# EAGLE design controller (EAGLE 6.3)
ABBREV: ctrl; PROJECT: Funksteckdose einfach Controller
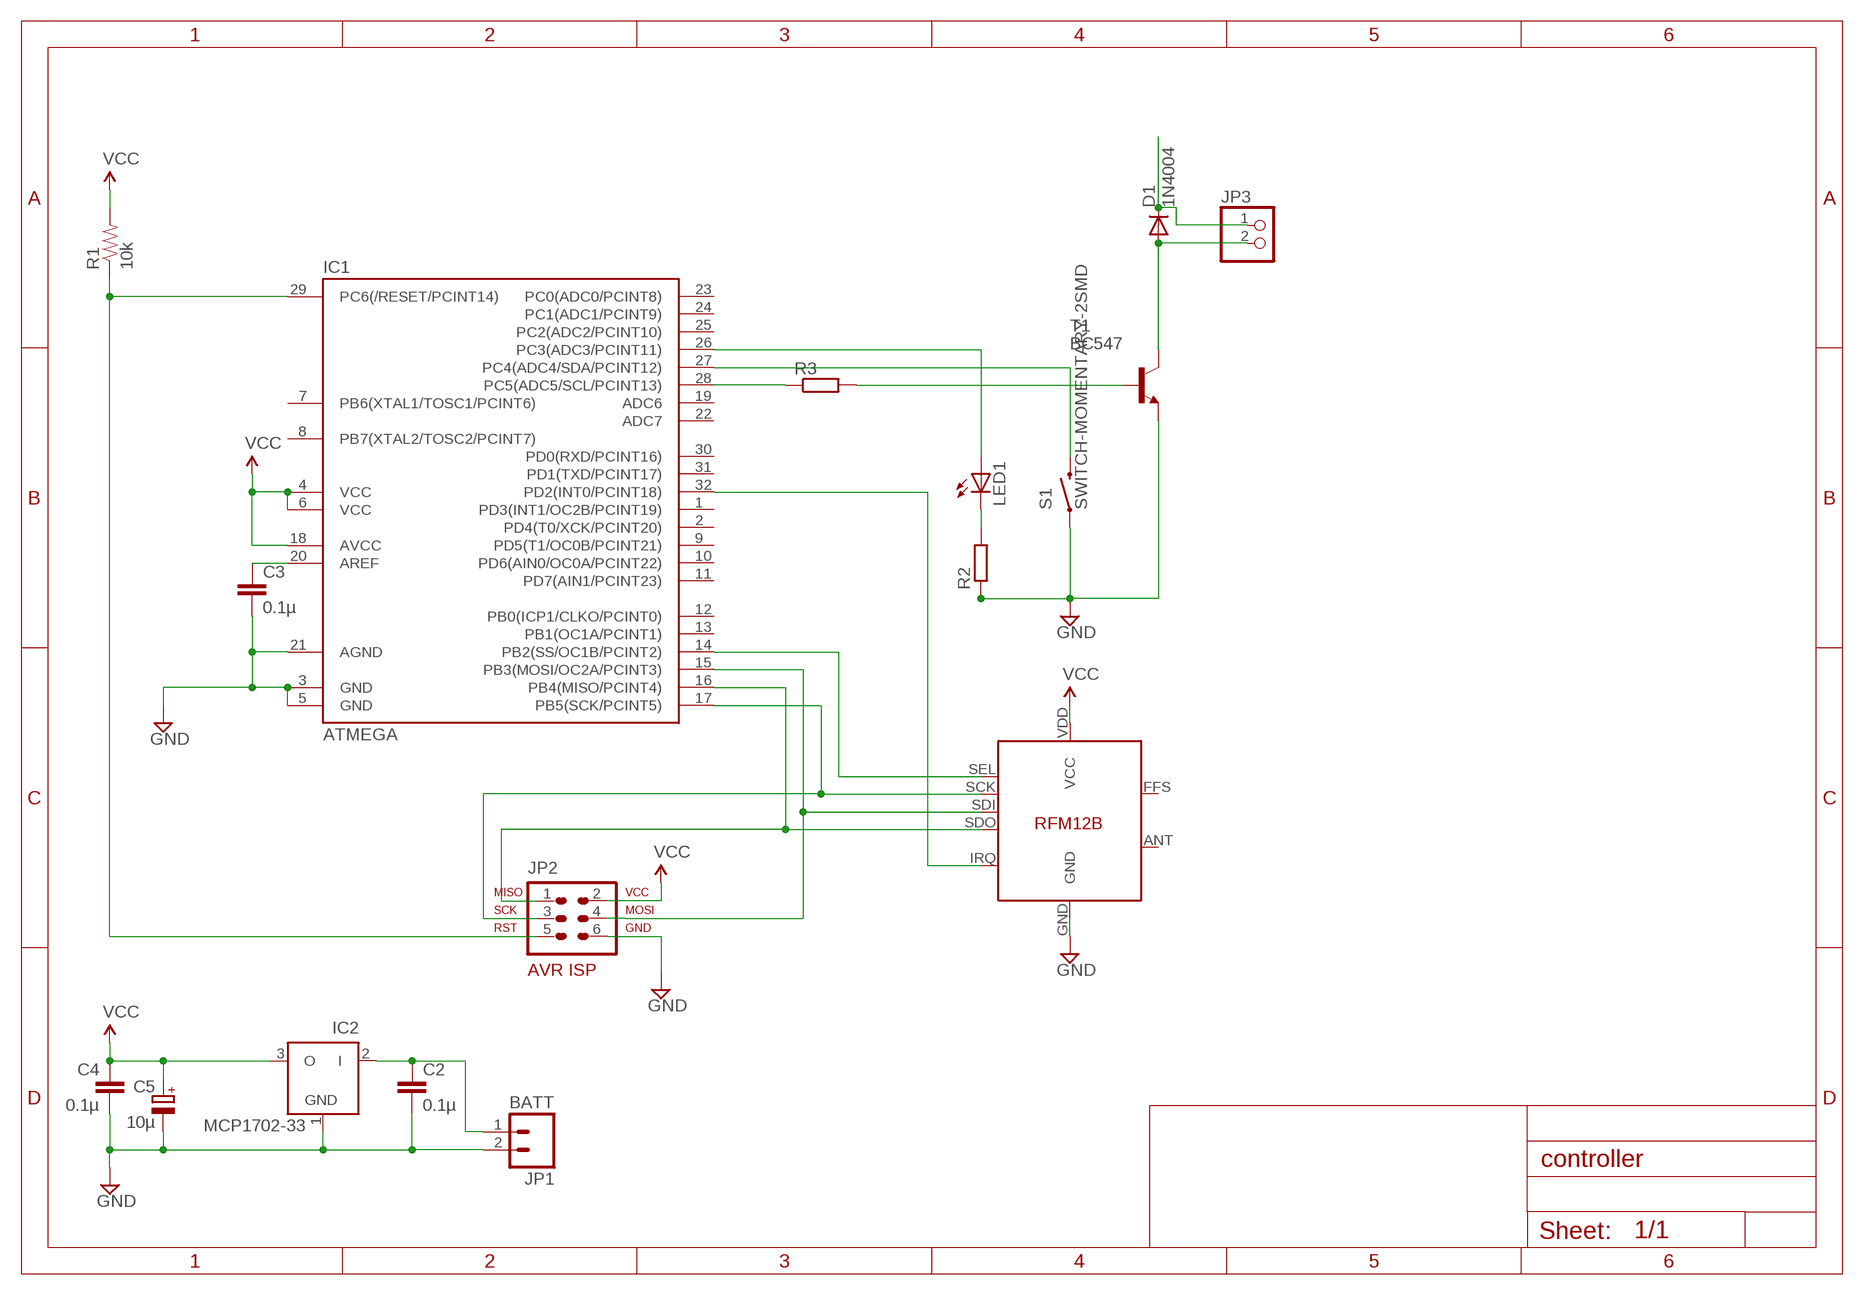
[diagram p0: schematic, sheet 1]

## Parts
C2  0.1µ  CAP0805  [0805]
C3  0.1µ  CAP0805  [0805]
C4  0.1µ  CAP0805  [0805]
C5  10µ  CPOL-EUE1.8-4  [E1,8-4]
D1  1N4004  [DO41-10]
IC1  ATMEGA  MEGA48/88/168-AU  [TQFP32-08]
IC2  MCP1702-33  MCP1702Z  [TO92]
JP1  BATT  M02LOCK_LONGPADS  [1X02_LOCK_LONGPADS]
JP2  AVR-ISP-6VERT  [AVR-ISP-6]
JP3  PINHD-1X2  [1X02]
LED1  LEDCHIPLED_0805  [CHIPLED_0805]
R1  10k  RESISTOR0805-RES  [0805]
R2  R-EU_0207/10  [0207/10]
R3  R-EU_0207/10  [0207/10]
S1  SWITCH-MOMENTARY-2SMD  [TACTILE_SWITCH_SMD]
T1  BC547  [TO92]
U$1  RFM12B  [RFM12B]

## Nets
GND [power]: C2.2 C3.2 C4.2 C5.- IC1.3(GND) IC1.5(GND) IC1.21(AGND) IC2.1(GND) JP1.2 JP2.6 R2.1 S1.1 T1.1(E) U$1.GND
IRQ: IC1.32(PD2(INT0/PCINT18)) U$1.IRQ
MISO: IC1.16(PB4(MISO/PCINT4)) JP2.1 U$1.SDO
MOSI: IC1.15(PB3(MOSI/OC2A/PCINT3)) JP2.4 U$1.SDI
N$1: IC1.28(PC5(ADC5/SCL/PCINT13)) R3.1
N$4: IC1.14(PB2(SS/OC1B/PCINT2)) U$1.SEL
N$6: LED1.C R2.2
N$8: IC1.27(PC4(ADC4/SDA/PCINT12)) S1.3
N$9: R3.2 T1.2(B)
N$10: D1.A JP3.2 T1.3(C)
N$11: IC1.26(PC3(ADC3/PCINT11)) LED1.A
N$19: C3.1 IC1.20(AREF)
PWR [power]: C2.1 D1.C IC2.2(I) JP1.1 JP3.1
RST: IC1.29(PC6(/RESET/PCINT14)) JP2.5 R1.1
SCK: IC1.17(PB5(SCK/PCINT5)) JP2.3 U$1.SCK
VCC [power]: C4.1 C5.+ IC1.4(VCC) IC1.6(VCC) IC1.18(AVCC) IC2.3(O) JP2.2 R1.2 U$1.VDD(VCC)
Unconnected: IC1.1(PD3(INT1/OC2B/PCINT19)) IC1.2(PD4(T0/XCK/PCINT20)) IC1.7(PB6(XTAL1/TOSC1/PCINT6)) IC1.8(PB7(XTAL2/TOSC2/PCINT7)) IC1.9(PD5(T1/OC0B/PCINT21)) IC1.10(PD6(AIN0/OC0A/PCINT22)) IC1.11(PD7(AIN1/PCINT23)) IC1.12(PB0(ICP1/CLKO/PCINT0)) IC1.13(PB1(OC1A/PCINT1)) IC1.19(ADC6) IC1.22(ADC7) IC1.23(PC0(ADC0/PCINT8)) IC1.24(PC1(ADC1/PCINT9)) IC1.25(PC2(ADC2/PCINT10)) IC1.30(PD0(RXD/PCINT16)) IC1.31(PD1(TXD/PCINT17)) U$1.ANT U$1.FFS

## Library data of the parts
C2-C4 = SparkFun:CAP: Capacitor Standard 0603 ceramic capacitor, and 0.1" leaded capacitor.
C5 = resistor:CPOL-EU: POLARIZED CAPACITOR, European symbol
D1 = diode:1N4004: DIODE general purpose rectifier, 1 A
IC1 = avr-7:MEGA48/88/168
IC2 = JeeLabs:MCP1702: 200 mA, Low Power Low Dropout Voltage Regulator
JP1 = SparkFun:M02: Header 2 Standard 2-pin 0.1" header. Use with straight break away headers (SKU : PRT-00116), right angle break away headers (PRT-00553), swiss pins (PRT-00743), machine pins (PRT-00117), and female headers (PRT-00115). Molex polarized connector foot print use with SKU : PRT-08233 with associated crimp pins and housings.
JP2 = avr-7:AVR-ISP-6: AVR ISP-6 Serial Programming Header
JP3 = pinhead:PINHD-1X2: PIN HEADER
LED1 = led:LED: LED OSRAM: - CHIPLED LG R971, LG N971, LY N971, LG Q971, LY Q971, LO R971, LY R971 LH N974, LH R974 LS Q976, LO Q976, LY Q976 LO Q996 - Hyper CHIPLED LW Q18S LB Q993, LB Q99A, LB R99A - SideLED LS A670, LO A670, LY A670, LG A670, LP A670 LB A673, LV A673, LT A673, LW A673 LH A674 LY A675 LS A676, LA A676, LO A676, LY A676, LW A676 LS A679, LY A679, LG A679 - Hyper Micro SIDELED® LS Y876, LA Y876, LO Y876, LY Y876 LT Y87S - SmartLED LW L88C, LW L88S LB L89C, LB L89S, LG L890 LS L89K, LO L89K, LY L89K LS L896, LA L896, LO L896, LY L896 - TOPLED LS T670, LO T670, LY T670, LG T670, LP T670 LSG T670, LSP T670, LSY T670, LOP T670, LYG T670 LG T671, LOG T671, LSG T671 LB T673, LV T673, LT T673, LW T673 LH T674 LS T676, LA T676, LO T676, LY T676, LB T676, LH T676, LSB T676, LW T676 LB T67C, LV T67C, LT T67C, LS T67K, LO T67K, LY T67K, LW E67C LS E67B, LA E67B, LO E67B, LY E67B, LB E67C, LV E67C, LT E67C LW T67C LS T679, LY T679, LG T679 LS T770, LO T770, LY T770, LG T770, LP T770 LB T773, LV T773, LT T773, LW T773 LH T774 LS E675, LA E675, LY E675, LS T675 LS T776, LA T776, LO T776, LY T776, LB T776 LHGB T686 LT T68C, LB T68C - Hyper Mini TOPLED® LB M676 - Mini TOPLED Santana® LG M470 LS M47K, LO M47K, LY M47K Source: http://www.osram.convergy.de LUXEON: - LUMILED® LXK2-PW12-R00, LXK2-PW12-S00, LXK2-PW14-U00, LXK2-PW14-V00 LXK2-PM12-R00, LXK2-PM12-S00, LXK2-PM14-U00 LXK2-PE12-Q00, LXK2-PE12-R00, LXK2-PE12-S00, LXK2-PE14-T00, LXK2-PE14-U00 LXK2-PB12-K00, LXK2-PB12-L00, LXK2-PB12-M00, LXK2-PB14-N00, LXK2-PB14-P00, LXK2-PB14-Q00 LXK2-PR12-L00, LXK2-PR12-M00, LXK2-PR14-Q00, LXK2-PR14-R00 LXK2-PD12-Q00, LXK2-PD12-R00, LXK2-PD12-S00 LXK2-PH12-R00, LXK2-PH12-S00 LXK2-PL12-P00, LXK2-PL12-Q00, LXK2-PL12-R00 Source: www.luxeon.com KINGBRIGHT: KA-3528ASYC Source: www.kingbright.com
R1 = SparkFun:RESISTOR: Resistor Basic schematic elements and footprints for 0603, 1206, and PTH resistors.
R2 R3 = rcl:R-EU_: RESISTOR, European symbol
S1 = SparkFun:SWITCH-MOMENTARY-2
T1 = transistor:BC547: NPN TRANSISTOR
U$1 = JeeLabs:RFM12B

## Net classes
1 power: width 0.381 mm, clearance 0.254 mm

## Board
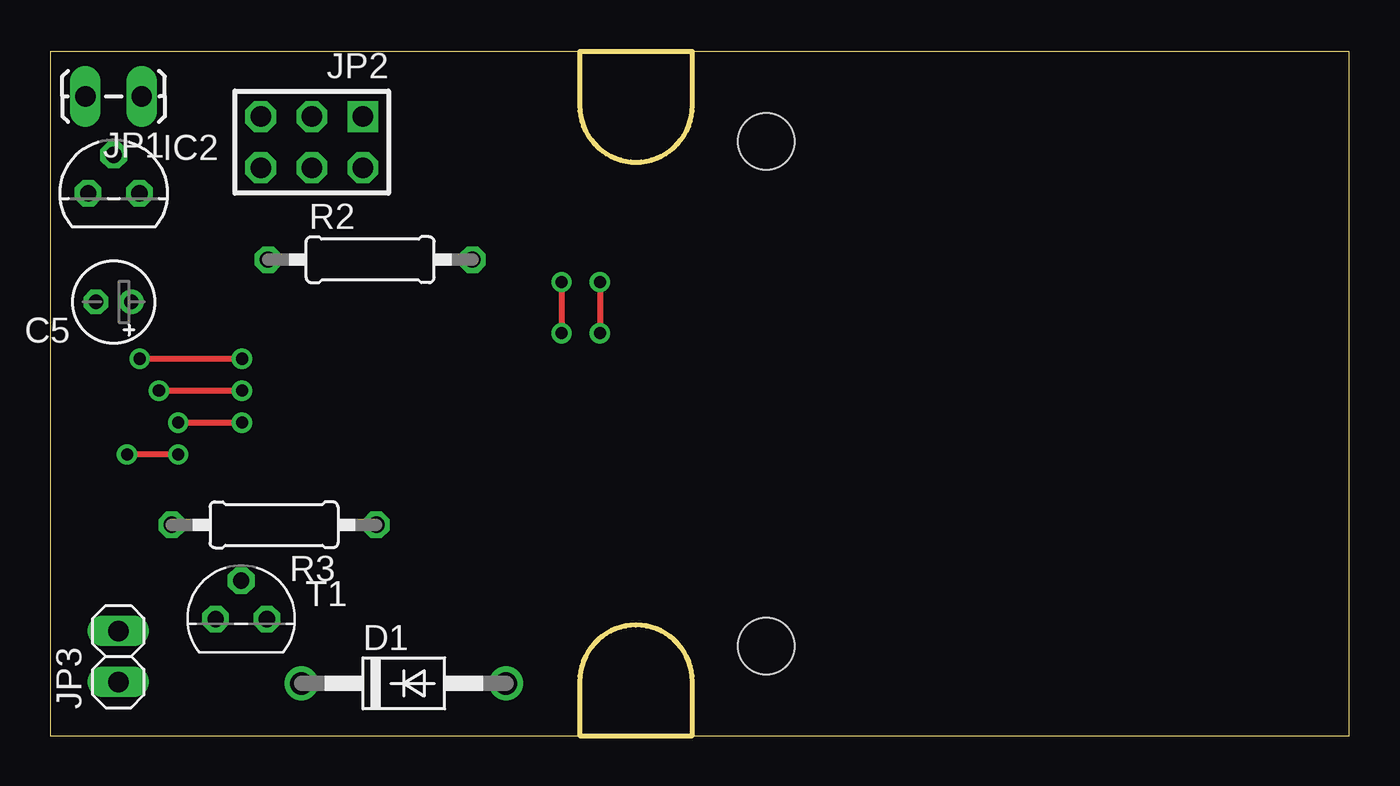
[diagram p1: board, top side]
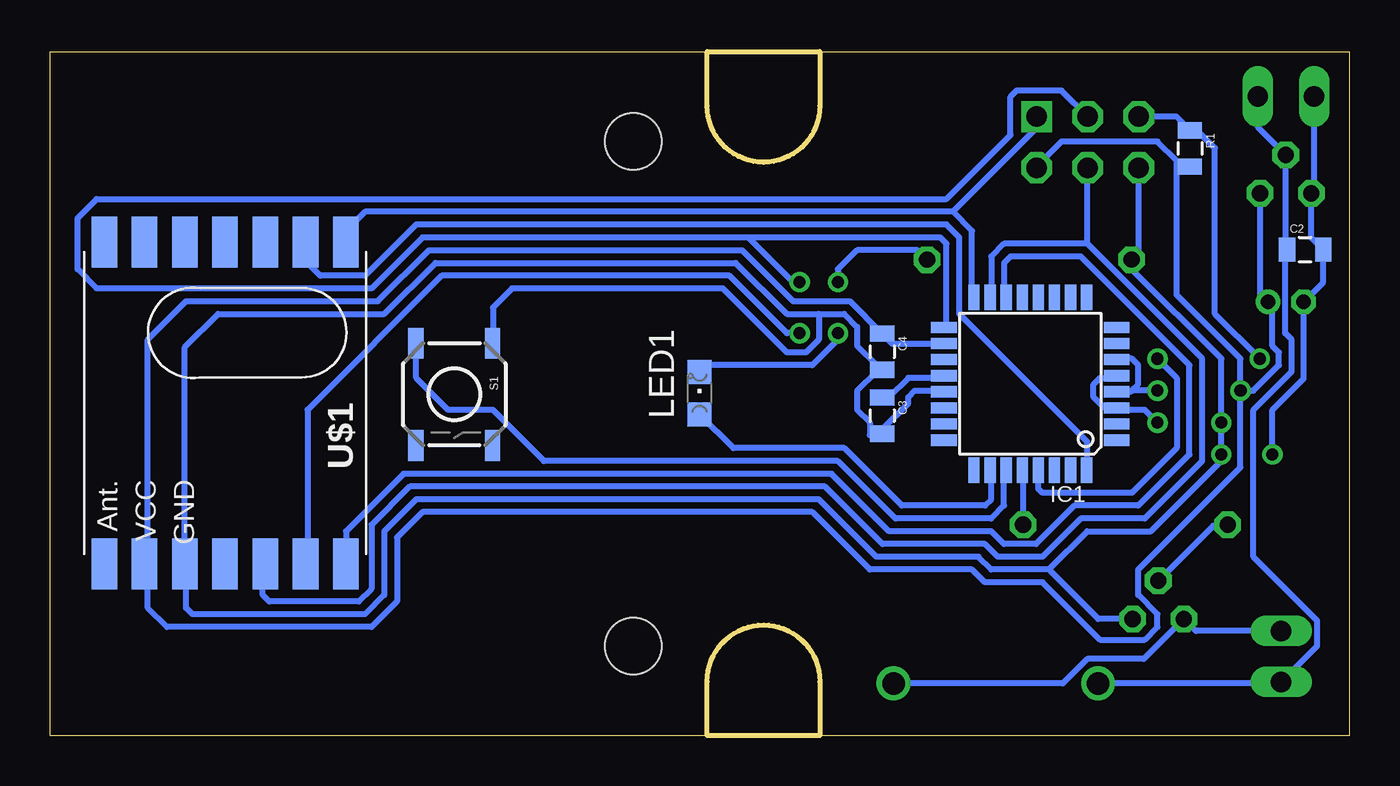
[diagram p2: board, bottom side, seen from below]

Size 64.53 x 34 mm. Coordinates in mm from the lower left corner, seen from the top.
Outline: 26.3,0 0,0 0,34 64.53,34 64.53,0 31.9,0
Outline: 26.3,0 31.9,0
Outline: 31.9,0 31.9,2.7 arc90 29.1,5.5 arc90 26.3,2.7 26.3,0
Outline: 31.9,34 26.3,34 26.3,31.3 arc90 29.1,28.5 arc90 31.9,31.3 31.9,34
Copper layers (1*16): Top 0.035mm / dielectric 1.5mm / Bottom 0.035mm
Design rules "default": minimum track width 10mil, minimum drill 24mil, track to track 8mil, track to pad 8mil, pad to pad 8mil, via to via 8mil, smd to smd 8mil, copper to edge 40mil, drill to drill 8mil, minimum pad ring 10mil, minimum via ring 8mil, stop-mask expansion 4mil, vias tented up to drill 0mil, thermal gap 10mil
Holes 2.8 mm at 35.56,29.53 35.56,4.45

### Footprints (pad centres in the part's own frame; a part is rotated, then mirrored left to right if it is on the bottom)
0805 = smd 0.8 x 1.2: 1 -0.9,0; 2 0.9,0
E1,8-4 = drill 0.711 pad 1.168 round: + -0.889,0 | drill 0.711 pad 1.168 octagon: - 0.889,0
DO41-10 = drill 1.118 round: A 5.08,0; C -5.08,0
TQFP32-08 = smd 1.27 x 0.559: 1 -4.293,2.8; 2 -4.293,2; 3 -4.293,1.2; 4 -4.293,0.4; 5 -4.293,-0.4; 6 -4.293,-1.2; 7 -4.293,-2; 8 -4.293,-2.8; 17 4.293,-2.8; 18 4.293,-2; 19 4.293,-1.2; 20 4.293,-0.4; 21 4.293,0.4; 22 4.293,1.2; 23 4.293,2; 24 4.293,2.8 | smd 0.559 x 1.27: 9 -2.8,-4.293; 10 -2,-4.293; 11 -1.2,-4.293; 12 -0.4,-4.293; 13 0.4,-4.293; 14 1.2,-4.293; 15 2,-4.293; 16 2.8,-4.293; 25 2.8,4.293; 26 2,4.293; 27 1.2,4.293; 28 0.4,4.293; 29 -0.4,4.293; 30 -1.2,4.293; 31 -2,4.293; 32 -2.8,4.293
TO92 = drill 0.813 octagon: 1 -1.27,0; 2 0,1.905; 3 1.27,0
1X02_LOCK_LONGPADS = drill 1.016 long: 1 -0.127,0; 2 2.667,0
AVR-ISP-6 = drill 1.016 square: 1 -2.54,-1.27 | drill 1.016 octagon: 2 -2.54,1.27; 3 0,-1.27; 4 0,1.27; 5 2.54,-1.27; 6 2.54,1.27
1X02 = drill 1.016 long: 1 -1.27,0; 2 1.27,0
CHIPLED_0805 = smd 1.2 x 1.2: A 0,-1.05; C 0,1.05
0207/10 = drill 0.813 octagon: 1 -5.08,0; 2 5.08,0
TACTILE_SWITCH_SMD = smd 1.524 x 0.762: 1 -2.54,1.905; 2 2.54,1.905; 3 -2.54,-1.905; 4 2.54,-1.905
TO92' = drill 0.813 octagon: 1 1.27,0; 2 0,1.905; 3 -1.27,0
RFM12B = smd 2.54 x 1.27: ANT 8,-6; FFS -8,2; GND 8,-2; IRQ -8,4; P$8 -8,0; P$9 -8,-2; P$10 -8,-4; P$12 -8,-6; P$16 8,0; SCK 8,4; SDI 8,2; SDO -8,6; SEL 8,6; VDD 8,-4

### Placement (x,y rotation side)
C2  2.19,24.16 0 bottom
C3  23.2,15.91 270 bottom
C4  23.2,19.08 270 bottom
C5  3.15,21.56 180 top
D1  17.56,2.6 0 top
IC1  15.84,17.49 180 bottom
IC2  3.15,26.95 0 top
JP1  4.41,31.77 180 top
JP2  12.99,29.5 180 top
JP3  3.38,3.94 90 top
LED1  32.27,17.02 0 bottom
R1  7.91,29.18 270 bottom
R2  15.89,23.66 0 top
R3  11.11,10.48 180 top
S1  44.46,16.96 270 bottom
T1  BC547  [TO92']  9.48,5.8 0 top
U$1  55.85,16.54 270 bottom

### Tracks (layer width: path | path; a pad name or v marks a point on that pad's centre or on a via)
GND  (via drill 0.6)
  Top 0.305: v6.35,15.56 v9.53,15.56 | v6.35,13.97 v3.81,13.97
  Bottom 0.305: IC1.21 20.32,17.14 21.59,17.14 21.91,16.83 21.91,16.51 23.18,15.24 C3.2 23.5,14.92 23.81,14.92 23.81,15.56 24.45,16.19 24.45,17.14 23.5,18.1 C4.2 23.5,18.41 24.45,19.37 24.45,20.32 25.08,20.95 26.35,20.95 | S1.1 42.55,19.68 42.55,21.27 41.59,22.23 31.11,22.23 27.94,19.05 26.99,19.05 26.35,19.68 26.35,20.95 | IC1.5 11.66,17.78 12.38,17.78 12.7,17.46 12.7,16.83 12.16,16.29 IC1.3 11.46,16.19 10.16,16.19 v9.53,15.56 | JP2.6 10.45,24.02 R2.1 10.81,23.2 6.35,18.73 v6.35,15.56 v6.35,13.97 6.35,13.65 9.84,10.16 13.02,10.16 14.92,8.26 | 14.92,8.26 17.78,8.26 18.41,8.89 23.5,8.89 26.35,11.75 46.35,11.75 47.94,10.16 47.94,6.99 48.9,6.03 57.47,6.03 57.78,6.35 57.78,8.47 U$1.GND 57.85,19.3 56.2,20.95 47.94,20.95 45.4,23.5 30.48,23.5 27.94,20.95 26.35,20.95 | JP1.2 1.75,27.09 IC2.1 1.88,24.75 C2.2 1.29,22.53 C5.- 2.26,17.74 3.81,16.19 v3.81,13.97 | T1.1 12.47,5.8 14.92,8.26
IRQ
  Bottom 0.305: U$1.IRQ 51.75,24.45 51.75,23.5 51.12,22.86 48.9,22.86 46.35,25.4 20,25.4 19.37,24.77 19.37,20.95 13.02,14.61 13.02,13.34 IC1.32
MISO
  Bottom 0.305: 18.73,21.91 IC1.16 18.73,21.87 18.73,25.08 19.68,26.04 | 15.56,30.48 JP2.1 15.56,30.74 15.56,30.16 19.68,26.04 | U$1.SDO 49.53,24.85 49.53,25.4 48.9,26.04 19.68,26.04
MOSI
  Bottom 0.305: 13.02,24.45 17.14,24.45 17.78,23.81 17.78,21.91 IC1.15 | 53.98,8.26 U$1.SDI 53.98,8.41 53.98,6.99 53.66,6.67 49.21,6.67 48.58,7.3 48.58,10.48 46.67,12.38 26.04,12.38 23.18,9.53 18.1,9.53 17.46,8.89 15.24,8.89 13.34,10.79 10.16,10.79 7.3,13.65 7.3,18.73 13.02,24.45 | 13.02,24.45 13.02,27.94 JP2.4
N$1
  Bottom 0.305: 16.19,13.02 IC1.28 16.19,13.14 R3.1
N$4
  Bottom 0.305: IC1.14 17.14,21.91 17.14,23.5 16.83,23.81 13.34,23.81 7.94,18.41 7.94,13.97 10.48,11.43 13.65,11.43 15.56,9.53 17.14,9.53 17.78,10.16 22.86,10.16 25.72,13.02 46.99,13.02 49.85,10.16 U$1.SEL
N$6  (via drill 0.6)
  Top 0.305: v25.4,22.54 v25.4,20
  Bottom 0.305: v25.4,20 25.4,19.68 26.67,18.41 31.93,18.41 LED1.C | v25.4,22.54 25.4,23.18 24.45,24.13 21.45,24.13 R2.2
N$8
  Bottom 0.305: S1.3 46.35,19.37 46.35,17.78 44.77,16.19 42.55,16.19 40.01,13.65 25.4,13.65 22.54,10.79 17.78,10.79 17.14,11.43 17.14,13.02 IC1.27
N$9
  Bottom 0.305: R3.2 5.99,10.44 6.75,10.44 T1.2
N$10
  Bottom 0.305: D1.A 14.23,2.6 13.02,3.81 10.2,3.81 T1.3 7.62,5.21 JP3.2
N$11
  Bottom 0.305: IC1.26 17.78,13.02 17.78,11.75 18.1,11.43 22.23,11.43 25.08,14.29 30.59,14.29 LED1.A
N$19
  Bottom 0.305: C3.1 23.18,16.83 22.86,16.83 21.91,17.78 20.32,17.78 IC1.20
PWR
  Bottom 0.305: JP1.1 4.54,30.25 IC2.2 3.15,24.21 C2.1 3.17,24.07 3.17,20 2.86,19.68 2.86,18.1 4.76,16.19 4.76,8.89 1.59,5.71 1.59,4.46 JP3.1 3.44,2.6 D1.C
RST  (via drill 0.6)
  Top 0.305: v4.45,18.73 v9.53,18.73
  Bottom 0.305: IC1.29 15.44,12.27 15.24,12.06 10.79,12.06 8.57,14.29 8.57,17.78 v9.53,18.73 | JP2.5 8.6,30.77 R1.1 7.54,30.08 6.67,29.21 6.67,20.95 v4.45,18.73
SCK  (via drill 0.6)
  Top 0.305: v27.3,22.54 v27.3,20
  Bottom 0.305: 20.32,20.32 IC1.17 20,20.42 20,24.45 20.32,24.77 29.84,24.77 | U$1.SCK 51.75,8.57 51.75,16.19 45.09,22.86 30.8,22.86 27.94,20 v27.3,20 | 13.02,30.8 JP2.3 14.29,32.06 14.29,32.07 16.51,32.07 16.83,31.75 16.83,29.84 20,26.67 62.23,26.67 63.18,25.72 63.18,23.18 62.23,22.23 48.58,22.23 46.04,24.77 29.84,24.77 | v27.3,22.54 27.62,22.54 29.84,24.77
VCC  (via drill 0.6)
  Top 0.305: v5.4,17.14 v9.53,17.14
  Bottom 0.305: IC1.4 10.85,17.09 10.79,17.14 | 10.79,17.14 10.48,17.46 10.48,18.41 10.79,18.73 11.51,18.73 IC1.6 | IC1.18 22.71,19.49 C4.1 24.81,21.59 27.62,21.59 30.16,24.13 45.72,24.13 48.26,21.59 57.78,21.59 59.69,19.68 59.69,8.69 U$1.VDD 59.69,8.38 59.69,6.35 58.74,5.4 48.58,5.4 47.31,6.67 47.31,9.84 46.04,11.11 26.67,11.11 23.81,8.26 18.73,8.26 18.1,7.62 15.24,7.62 12.38,4.76 10.16,4.76 9.53,5.4 9.53,6.03 10.48,6.99 10.48,8.26 5.4,13.34 v5.4,17.14 | JP2.2 15.53,28.28 14.29,29.53 9.53,29.53 8.57,28.57 8.57,28.26 | v5.4,17.14 5.4,18.73 8.57,21.91 8.57,28.26 | v9.53,17.14 10.79,17.14 | 8.57,28.26 7.93,28.26 R1.2 | IC2.3 4.42,21.94 4.13,21.65 | 4.13,21.65 C5.+ | 4.13,21.65 4.13,21.59 3.81,21.27 3.81,19.37 3.49,19.05 3.49,18.41 4.76,17.14 v5.4,17.14